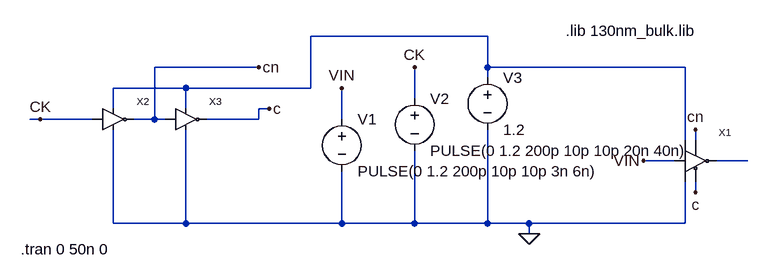
[diagram p0: schematic Draft7.asc]
Draft7.asc, the LTspice schematic file:
Version 4
SHEET 1 880 680
WIRE -96 -32 -368 -32
WIRE -448 16 -608 16
WIRE -96 16 -96 -32
WIRE 208 16 -96 16
WIRE -96 32 -96 16
WIRE -560 48 -672 48
WIRE -368 48 -368 -32
WIRE -368 48 -560 48
WIRE -208 64 -208 16
WIRE -672 80 -672 48
WIRE -560 80 -560 48
WIRE -432 80 -448 80
WIRE -784 96 -800 96
WIRE -704 96 -784 96
WIRE -608 96 -608 16
WIRE -608 96 -640 96
WIRE -592 96 -608 96
WIRE -448 96 -448 80
WIRE -448 96 -528 96
WIRE -320 96 -320 48
WIRE 208 128 208 16
WIRE 224 128 224 112
WIRE 192 160 144 160
WIRE 304 160 256 160
WIRE 224 208 224 192
WIRE -672 256 -672 112
WIRE -560 256 -560 112
WIRE -560 256 -672 256
WIRE -320 256 -320 176
WIRE -320 256 -560 256
WIRE -208 256 -208 144
WIRE -208 256 -320 256
WIRE -96 256 -96 112
WIRE -96 256 -208 256
WIRE -32 256 -96 256
WIRE 208 256 208 192
WIRE 208 256 -32 256
WIRE -32 272 -32 256
FLAG -32 272 0
FLAG -784 96 CK
FLAG -448 16 cn
FLAG -432 80 c
FLAG -320 48 VIN
FLAG 144 160 VIN
FLAG -208 16 CK
FLAG 224 112 cn
FLAG 224 208 c
SYMBOL Tristate_Inv 288 192 R0
SYMATTR InstName X1
SYMBOL voltage -320 80 R0
WINDOW 123 0 0 Left 0
WINDOW 39 0 0 Left 0
SYMATTR InstName V1
SYMATTR Value PULSE(0 1.2 200p 10p 10p 3n 6n)
SYMBOL voltage -208 48 R0
WINDOW 123 0 0 Left 0
WINDOW 39 0 0 Left 0
SYMATTR InstName V2
SYMATTR Value PULSE(0 1.2 200p 10p 10p 20n 40n)
SYMBOL voltage -96 16 R0
WINDOW 123 0 0 Left 0
WINDOW 39 0 0 Left 0
SYMATTR InstName V3
SYMATTR Value 1.2
SYMBOL Inverter -640 112 R0
SYMATTR InstName X2
SYMBOL Inverter -528 112 R0
SYMATTR InstName X3
TEXT 24 -40 Left 2 !.lib 130nm_bulk.lib
TEXT -814 296 Left 2 !.tran 0 50n 0

The netlist it stands for:
* Draft7.asc
XX1 VIN N001 0 cn c N002 Tristate_Inv  ; pins In VDD GND EN NEN Out
V1 VIN 0 PULSE(0 1.2 200p 10p 10p 3n 6n)
V2 CK 0 PULSE(0 1.2 200p 10p 10p 20n 40n)
V3 N001 0 1.2
XX2 CK N001 0 cn Inverter  ; pins In VDD GND Out
XX3 cn N001 0 c Inverter  ; pins In VDD GND Out
.lib 130nm_bulk.lib
.tran 0 50n 0
.backanno
.end